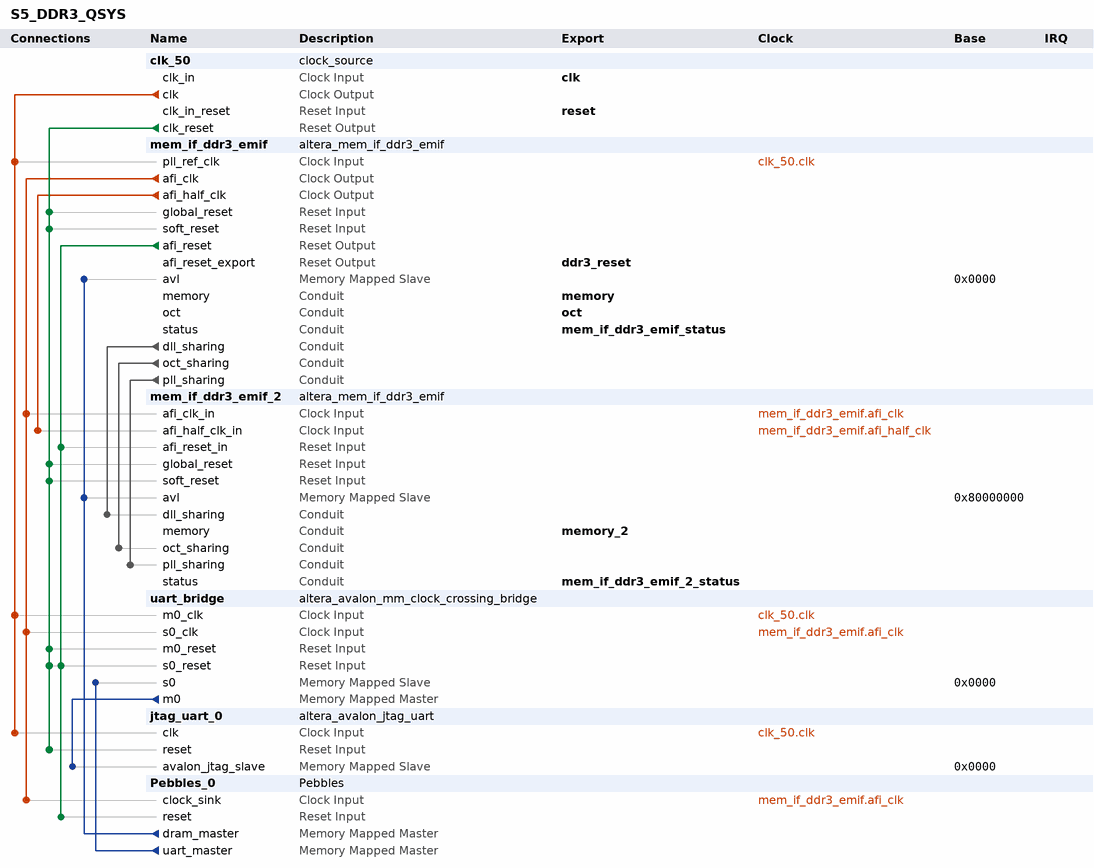
[diagram p0: system contents]
# Platform Designer (Qsys) system S5_DDR3_QSYS, Stratix V 5SGXEA7N2F45C2
# Parameters at their usual value, and those the tool derives, are not listed.
package require -exact qsys 16.1
create_system S5_DDR3_QSYS
set_project_property DEVICE_FAMILY {Stratix V}
set_project_property DEVICE 5SGXEA7N2F45C2

add_instance clk_50 clock_source 16.1
set_instance_parameter_value clk_50 clockFrequency 50000000

add_instance mem_if_ddr3_emif altera_mem_if_ddr3_emif 16.1
set_instance_parameter_value mem_if_ddr3_emif AVL_MAX_SIZE 8
set_instance_parameter_value mem_if_ddr3_emif CALIBRATION_MODE Skip
set_instance_parameter_value mem_if_ddr3_emif CPORT_TYPE_PORT Bidirectional,Bidirectional,Bidirectional,Bidirectional,Bidirectional,Bidirectional
set_instance_parameter_value mem_if_ddr3_emif CTL_LOOK_AHEAD_DEPTH 8
set_instance_parameter_value mem_if_ddr3_emif DLL_SHARING_MODE Master
set_instance_parameter_value mem_if_ddr3_emif EXPORT_AFI_HALF_CLK false
set_instance_parameter_value mem_if_ddr3_emif HARD_EMIF false
set_instance_parameter_value mem_if_ddr3_emif MEM_BANKADDR_WIDTH 3
set_instance_parameter_value mem_if_ddr3_emif MEM_CLK_FREQ 800.0
set_instance_parameter_value mem_if_ddr3_emif MEM_CLK_FREQ_MAX 800.0
set_instance_parameter_value mem_if_ddr3_emif MEM_COL_ADDR_WIDTH 10
set_instance_parameter_value mem_if_ddr3_emif MEM_DQ_WIDTH 64
set_instance_parameter_value mem_if_ddr3_emif MEM_FORMAT UNBUFFERED
set_instance_parameter_value mem_if_ddr3_emif MEM_ROW_ADDR_WIDTH 15
set_instance_parameter_value mem_if_ddr3_emif MEM_TCL 11
set_instance_parameter_value mem_if_ddr3_emif MEM_TFAW_NS 30.0
set_instance_parameter_value mem_if_ddr3_emif MEM_TRAS_NS 35.0
set_instance_parameter_value mem_if_ddr3_emif MEM_TRCD_NS 13.75
set_instance_parameter_value mem_if_ddr3_emif MEM_TRFC_NS 160.0
set_instance_parameter_value mem_if_ddr3_emif MEM_TRP_NS 13.75
set_instance_parameter_value mem_if_ddr3_emif MEM_TRRD_NS 6.0
set_instance_parameter_value mem_if_ddr3_emif MEM_TRTP_NS 7.5
set_instance_parameter_value mem_if_ddr3_emif MEM_TWTR 4
set_instance_parameter_value mem_if_ddr3_emif MEM_VENDOR Micron
set_instance_parameter_value mem_if_ddr3_emif MEM_WTCL 8
set_instance_parameter_value mem_if_ddr3_emif OCT_SHARING_MODE Master
set_instance_parameter_value mem_if_ddr3_emif PLL_LOCATION Left_Right
set_instance_parameter_value mem_if_ddr3_emif PLL_SHARING_MODE Master
set_instance_parameter_value mem_if_ddr3_emif POWER_OF_TWO_BUS true
set_instance_parameter_value mem_if_ddr3_emif PRIORITY_PORT 0,1,1,1,1,1
set_instance_parameter_value mem_if_ddr3_emif RATE Quarter
set_instance_parameter_value mem_if_ddr3_emif REF_CLK_FREQ 50.0
set_instance_parameter_value mem_if_ddr3_emif SPEED_GRADE 2
set_instance_parameter_value mem_if_ddr3_emif TIMING_BOARD_AC_SKEW 0.05
set_instance_parameter_value mem_if_ddr3_emif TIMING_BOARD_AC_TO_CK_SKEW 0.012
set_instance_parameter_value mem_if_ddr3_emif TIMING_BOARD_DQ_TO_DQS_SKEW 0.002
set_instance_parameter_value mem_if_ddr3_emif TIMING_BOARD_MAX_CK_DELAY 1.78
set_instance_parameter_value mem_if_ddr3_emif TIMING_BOARD_MAX_DQS_DELAY 0.7
set_instance_parameter_value mem_if_ddr3_emif TIMING_BOARD_SKEW_BETWEEN_DQS 0.1
set_instance_parameter_value mem_if_ddr3_emif TIMING_BOARD_SKEW_CKDQS_DIMM_MAX 1.29
set_instance_parameter_value mem_if_ddr3_emif TIMING_BOARD_SKEW_CKDQS_DIMM_MIN 0.06
set_instance_parameter_value mem_if_ddr3_emif TIMING_BOARD_SKEW_WITHIN_DQS 0.009
set_instance_parameter_value mem_if_ddr3_emif TIMING_TDH 45
set_instance_parameter_value mem_if_ddr3_emif TIMING_TDQSCK 255
set_instance_parameter_value mem_if_ddr3_emif TIMING_TDQSQ 100
set_instance_parameter_value mem_if_ddr3_emif TIMING_TDQSS 0.27
set_instance_parameter_value mem_if_ddr3_emif TIMING_TDS 10
set_instance_parameter_value mem_if_ddr3_emif TIMING_TDSH 0.18
set_instance_parameter_value mem_if_ddr3_emif TIMING_TDSS 0.18
set_instance_parameter_value mem_if_ddr3_emif TIMING_TIH 120
set_instance_parameter_value mem_if_ddr3_emif TIMING_TIS 170
set_instance_parameter_value mem_if_ddr3_emif TIMING_TQSH 0.4
set_instance_parameter_value mem_if_ddr3_emif USER_DEBUG_LEVEL 0

add_instance mem_if_ddr3_emif_2 altera_mem_if_ddr3_emif 16.1
set_instance_parameter_value mem_if_ddr3_emif_2 AVL_MAX_SIZE 8
set_instance_parameter_value mem_if_ddr3_emif_2 CALIBRATION_MODE Skip
set_instance_parameter_value mem_if_ddr3_emif_2 CPORT_TYPE_PORT Bidirectional,Bidirectional,Bidirectional,Bidirectional,Bidirectional,Bidirectional
set_instance_parameter_value mem_if_ddr3_emif_2 CTL_LOOK_AHEAD_DEPTH 8
set_instance_parameter_value mem_if_ddr3_emif_2 DLL_SHARING_MODE Slave
set_instance_parameter_value mem_if_ddr3_emif_2 EXPORT_AFI_HALF_CLK false
set_instance_parameter_value mem_if_ddr3_emif_2 HARD_EMIF false
set_instance_parameter_value mem_if_ddr3_emif_2 MEM_BANKADDR_WIDTH 3
set_instance_parameter_value mem_if_ddr3_emif_2 MEM_CLK_FREQ 800.0
set_instance_parameter_value mem_if_ddr3_emif_2 MEM_CLK_FREQ_MAX 800.0
set_instance_parameter_value mem_if_ddr3_emif_2 MEM_COL_ADDR_WIDTH 10
set_instance_parameter_value mem_if_ddr3_emif_2 MEM_DQ_WIDTH 64
set_instance_parameter_value mem_if_ddr3_emif_2 MEM_FORMAT UNBUFFERED
set_instance_parameter_value mem_if_ddr3_emif_2 MEM_ROW_ADDR_WIDTH 15
set_instance_parameter_value mem_if_ddr3_emif_2 MEM_TCL 11
set_instance_parameter_value mem_if_ddr3_emif_2 MEM_TFAW_NS 30.0
set_instance_parameter_value mem_if_ddr3_emif_2 MEM_TRAS_NS 35.0
set_instance_parameter_value mem_if_ddr3_emif_2 MEM_TRCD_NS 13.75
set_instance_parameter_value mem_if_ddr3_emif_2 MEM_TRFC_NS 160.0
set_instance_parameter_value mem_if_ddr3_emif_2 MEM_TRP_NS 13.75
set_instance_parameter_value mem_if_ddr3_emif_2 MEM_TRRD_NS 6.0
set_instance_parameter_value mem_if_ddr3_emif_2 MEM_TRTP_NS 7.5
set_instance_parameter_value mem_if_ddr3_emif_2 MEM_TWTR 4
set_instance_parameter_value mem_if_ddr3_emif_2 MEM_VENDOR Micron
set_instance_parameter_value mem_if_ddr3_emif_2 MEM_WTCL 8
set_instance_parameter_value mem_if_ddr3_emif_2 OCT_SHARING_MODE Slave
set_instance_parameter_value mem_if_ddr3_emif_2 PLL_LOCATION Left_Right
set_instance_parameter_value mem_if_ddr3_emif_2 PLL_SHARING_MODE Slave
set_instance_parameter_value mem_if_ddr3_emif_2 POWER_OF_TWO_BUS true
set_instance_parameter_value mem_if_ddr3_emif_2 PRIORITY_PORT 0,1,1,1,1,1
set_instance_parameter_value mem_if_ddr3_emif_2 RATE Quarter
set_instance_parameter_value mem_if_ddr3_emif_2 REF_CLK_FREQ 50.0
set_instance_parameter_value mem_if_ddr3_emif_2 SPEED_GRADE 2
set_instance_parameter_value mem_if_ddr3_emif_2 TIMING_BOARD_AC_SKEW 0.05
set_instance_parameter_value mem_if_ddr3_emif_2 TIMING_BOARD_AC_TO_CK_SKEW 0.012
set_instance_parameter_value mem_if_ddr3_emif_2 TIMING_BOARD_DQ_TO_DQS_SKEW 0.002
set_instance_parameter_value mem_if_ddr3_emif_2 TIMING_BOARD_MAX_CK_DELAY 1.78
set_instance_parameter_value mem_if_ddr3_emif_2 TIMING_BOARD_MAX_DQS_DELAY 0.7
set_instance_parameter_value mem_if_ddr3_emif_2 TIMING_BOARD_SKEW_BETWEEN_DQS 0.1
set_instance_parameter_value mem_if_ddr3_emif_2 TIMING_BOARD_SKEW_CKDQS_DIMM_MAX 1.29
set_instance_parameter_value mem_if_ddr3_emif_2 TIMING_BOARD_SKEW_CKDQS_DIMM_MIN 0.06
set_instance_parameter_value mem_if_ddr3_emif_2 TIMING_BOARD_SKEW_WITHIN_DQS 0.009
set_instance_parameter_value mem_if_ddr3_emif_2 TIMING_TDH 45
set_instance_parameter_value mem_if_ddr3_emif_2 TIMING_TDQSCK 255
set_instance_parameter_value mem_if_ddr3_emif_2 TIMING_TDQSQ 100
set_instance_parameter_value mem_if_ddr3_emif_2 TIMING_TDQSS 0.27
set_instance_parameter_value mem_if_ddr3_emif_2 TIMING_TDS 10
set_instance_parameter_value mem_if_ddr3_emif_2 TIMING_TDSH 0.18
set_instance_parameter_value mem_if_ddr3_emif_2 TIMING_TDSS 0.18
set_instance_parameter_value mem_if_ddr3_emif_2 TIMING_TIH 120
set_instance_parameter_value mem_if_ddr3_emif_2 TIMING_TIS 170
set_instance_parameter_value mem_if_ddr3_emif_2 TIMING_TQSH 0.4
set_instance_parameter_value mem_if_ddr3_emif_2 USER_DEBUG_LEVEL 0

add_instance uart_bridge altera_avalon_mm_clock_crossing_bridge 16.1
set_instance_parameter_value uart_bridge ADDRESS_WIDTH 10
set_instance_parameter_value uart_bridge COMMAND_FIFO_DEPTH 4
set_instance_parameter_value uart_bridge DATA_WIDTH 32
set_instance_parameter_value uart_bridge MASTER_SYNC_DEPTH 2
set_instance_parameter_value uart_bridge MAX_BURST_SIZE 1
set_instance_parameter_value uart_bridge RESPONSE_FIFO_DEPTH 4
set_instance_parameter_value uart_bridge SLAVE_SYNC_DEPTH 2
set_instance_parameter_value uart_bridge USE_AUTO_ADDRESS_WIDTH 1

add_instance jtag_uart_0 altera_avalon_jtag_uart 16.1
set_instance_parameter_value jtag_uart_0 simInteractiveOptions NO_INTERACTIVE_WINDOWS

add_instance Pebbles_0 Pebbles 1.0

# connections
add_connection clk_50.clk jtag_uart_0.clk clock
add_connection clk_50.clk mem_if_ddr3_emif.pll_ref_clk clock
add_connection clk_50.clk uart_bridge.m0_clk clock
add_connection mem_if_ddr3_emif.afi_clk mem_if_ddr3_emif_2.afi_clk_in clock
add_connection mem_if_ddr3_emif.afi_clk Pebbles_0.clock_sink clock
add_connection mem_if_ddr3_emif.afi_clk uart_bridge.s0_clk clock
add_connection mem_if_ddr3_emif.afi_half_clk mem_if_ddr3_emif_2.afi_half_clk_in clock
add_connection clk_50.clk_reset jtag_uart_0.reset reset
add_connection clk_50.clk_reset mem_if_ddr3_emif.global_reset reset
add_connection clk_50.clk_reset mem_if_ddr3_emif.soft_reset reset
add_connection clk_50.clk_reset mem_if_ddr3_emif_2.global_reset reset
add_connection clk_50.clk_reset mem_if_ddr3_emif_2.soft_reset reset
add_connection clk_50.clk_reset uart_bridge.m0_reset reset
add_connection clk_50.clk_reset uart_bridge.s0_reset reset
add_connection mem_if_ddr3_emif.afi_reset mem_if_ddr3_emif_2.afi_reset_in reset
add_connection mem_if_ddr3_emif.afi_reset Pebbles_0.reset reset
add_connection mem_if_ddr3_emif.afi_reset uart_bridge.s0_reset reset
add_connection Pebbles_0.dram_master mem_if_ddr3_emif.avl avalon
set_connection_parameter_value Pebbles_0.dram_master/mem_if_ddr3_emif.avl baseAddress 0x0000
add_connection Pebbles_0.dram_master mem_if_ddr3_emif_2.avl avalon
set_connection_parameter_value Pebbles_0.dram_master/mem_if_ddr3_emif_2.avl baseAddress 0x80000000
add_connection Pebbles_0.uart_master uart_bridge.s0 avalon
set_connection_parameter_value Pebbles_0.uart_master/uart_bridge.s0 baseAddress 0x0000
add_connection uart_bridge.m0 jtag_uart_0.avalon_jtag_slave avalon
set_connection_parameter_value uart_bridge.m0/jtag_uart_0.avalon_jtag_slave baseAddress 0x0000
add_connection mem_if_ddr3_emif.dll_sharing mem_if_ddr3_emif_2.dll_sharing conduit
add_connection mem_if_ddr3_emif.oct_sharing mem_if_ddr3_emif_2.oct_sharing conduit
add_connection mem_if_ddr3_emif.pll_sharing mem_if_ddr3_emif_2.pll_sharing conduit

# exported interfaces
add_interface clk clock sink
set_interface_property clk EXPORT_OF clk_50.clk_in
add_interface ddr3_reset reset source
set_interface_property ddr3_reset EXPORT_OF mem_if_ddr3_emif.afi_reset_export
add_interface mem_if_ddr3_emif_2_status conduit end
set_interface_property mem_if_ddr3_emif_2_status EXPORT_OF mem_if_ddr3_emif_2.status
add_interface mem_if_ddr3_emif_status conduit end
set_interface_property mem_if_ddr3_emif_status EXPORT_OF mem_if_ddr3_emif.status
add_interface memory conduit end
set_interface_property memory EXPORT_OF mem_if_ddr3_emif.memory
add_interface memory_2 conduit end
set_interface_property memory_2 EXPORT_OF mem_if_ddr3_emif_2.memory
add_interface oct conduit end
set_interface_property oct EXPORT_OF mem_if_ddr3_emif.oct
add_interface reset reset sink
set_interface_property reset EXPORT_OF clk_50.clk_in_reset

set_interconnect_requirement {$system} qsys_mm.clockCrossingAdapter FIFO
set_interconnect_requirement {$system} qsys_mm.maxAdditionalLatency 4

save_system S5_DDR3_QSYS.qsys
